# Altium project ISO.PrjPcb
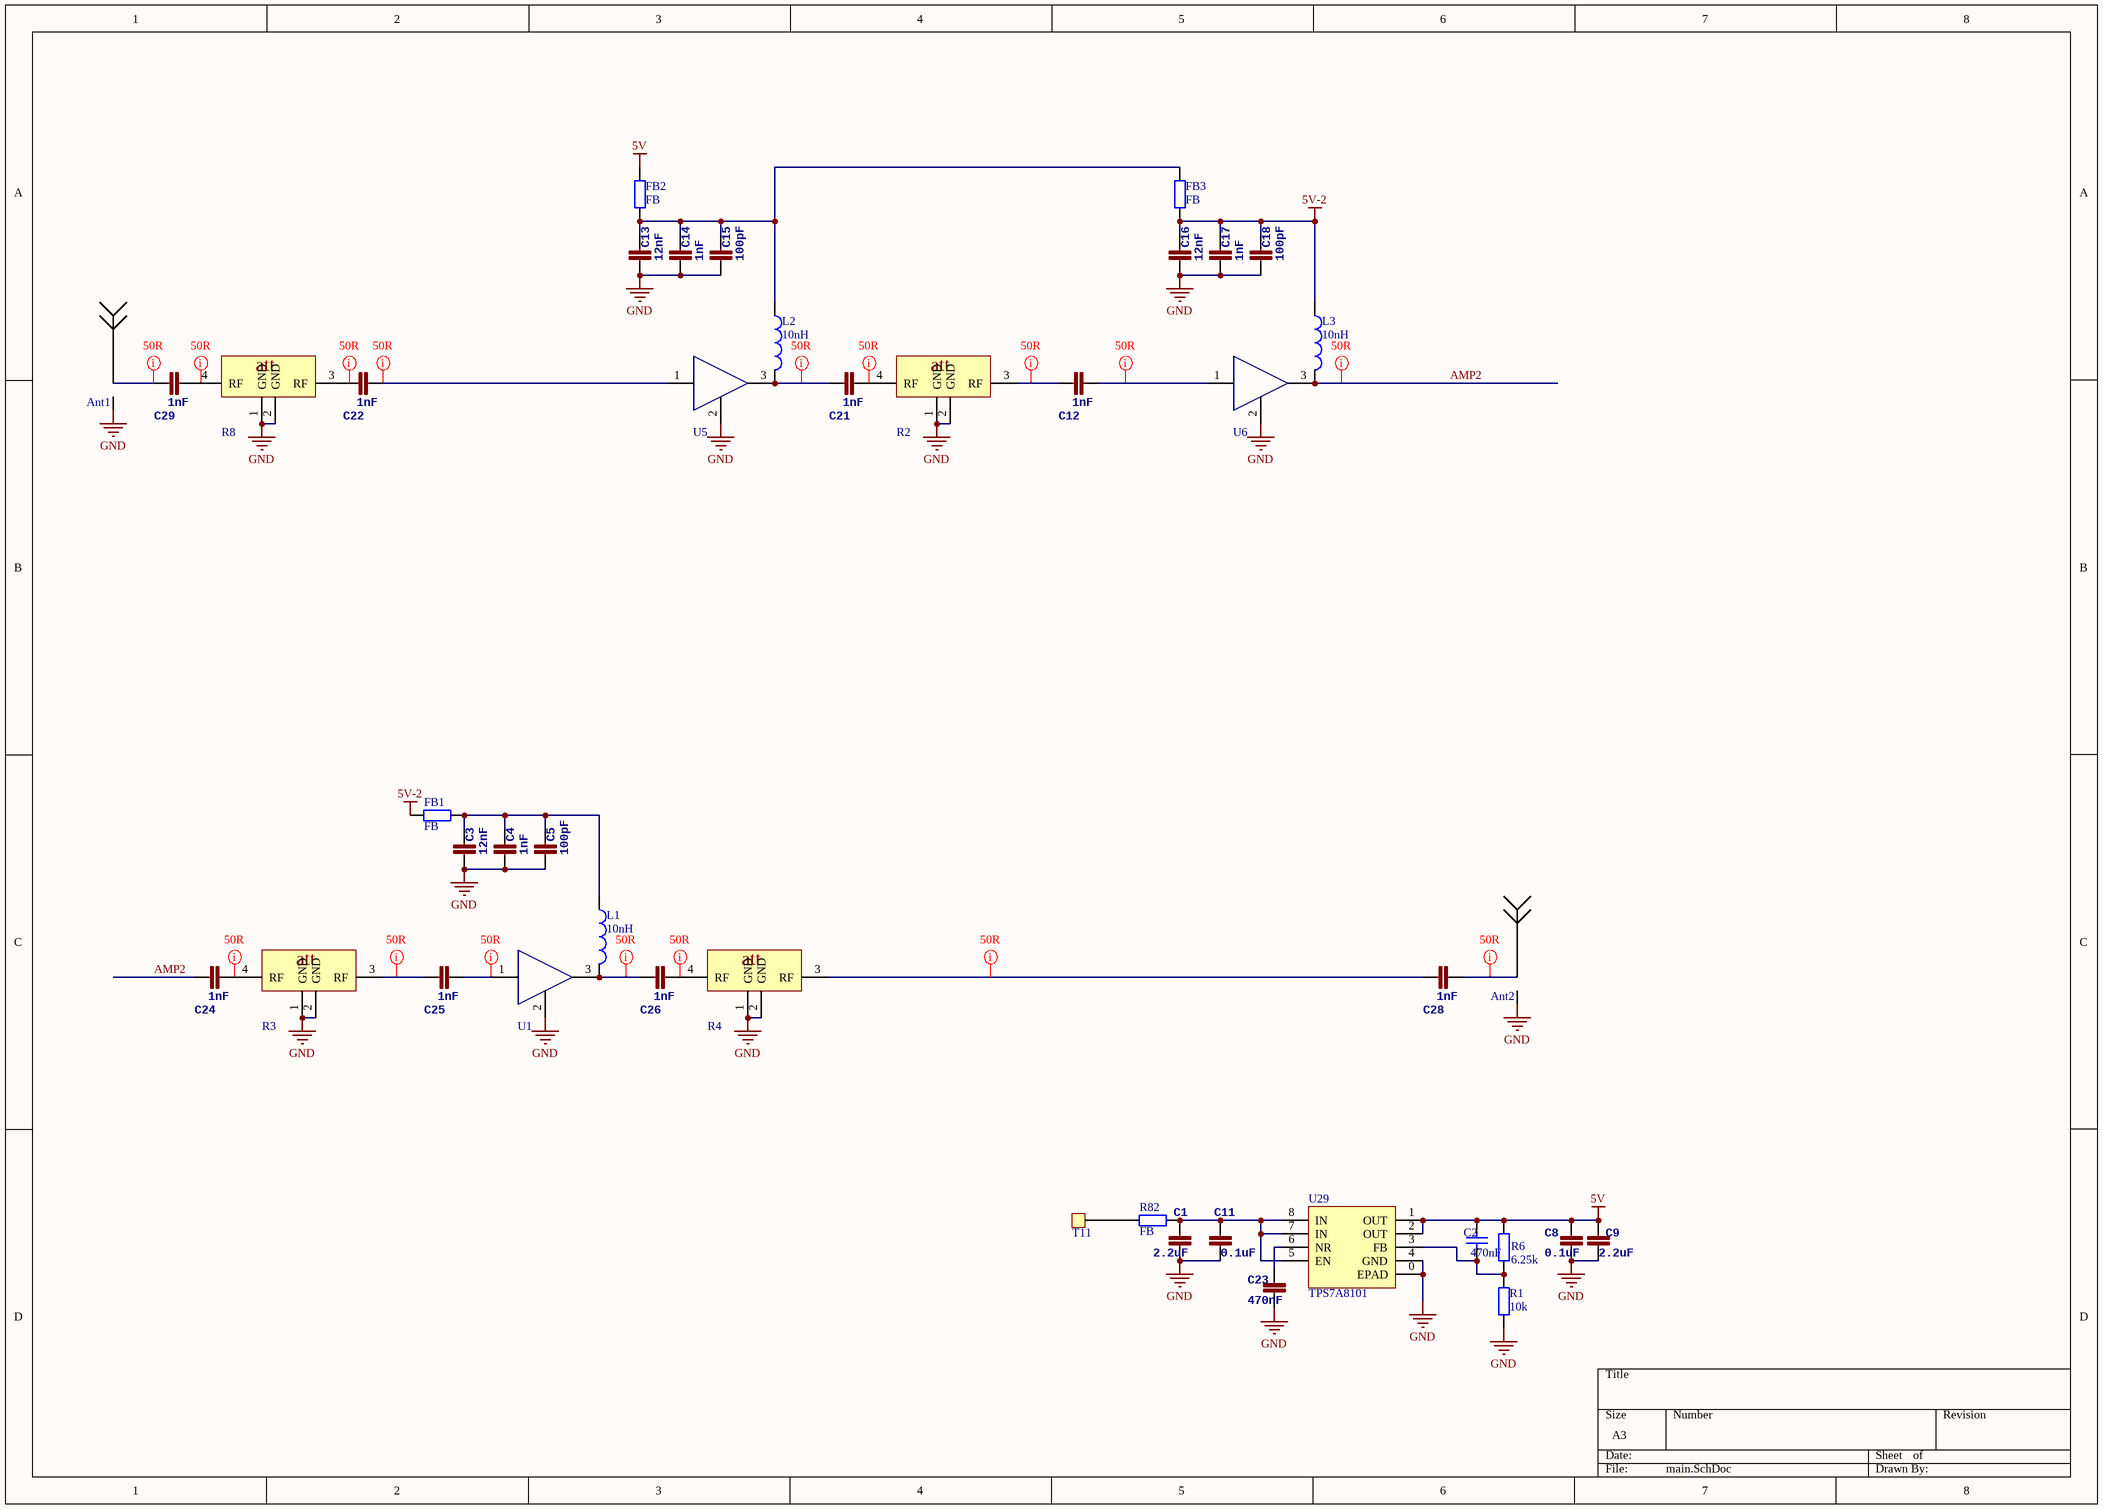
[diagram p0: main.SchDoc]
1 sheet, 43 parts. Net scope: global (net labels, ports and power ports of the same name join across sheets).
Board file: ISO.PcbDoc

## Sheet main.SchDoc
size A3

### Parts
Ant1  Antenna  [SMA-2]  (value not drawn)
Ant2  Antenna  [SMA-2]  (value not drawn)
C1  2.2uF  [0603]
C2  470nF  [0402]
C3  12nF  [0805]
C4  1nF  [0402]
C5  100pF  [0402]
C8  0.1uF  [0603]
C9  2.2uF  [0603]
C11  0.1uF  [0402]
C12  1nF  [0402]
C13  12nF  [0805]
C14  1nF  [0402]
C15  100pF  [0402]
C16  12nF  [0805]
C17  1nF  [0402]
C18  100pF  [0402]
C21  1nF  [0402]
C22  1nF  [0402]
C23  470nF  [0402]
C24  1nF  [0402]
C25  1nF  [0402]
C26  1nF  [0402]
C28  1nF  [0402]
C29  1nF  [0402]
FB1  FB  [0603]
FB2  FB  [0603]
FB3  FB  [0603]
L1  value 10nH  [0402]  (hidden comment: Inductor)
L2  value 10nH  [0402]  (hidden comment: Inductor)
L3  value 10nH  [0402]  (hidden comment: Inductor)
R1  10k  [0402]
R2  EXB24-RF-ATT  [EXB24AT-RF-ATT]  (value not drawn)
R3  EXB24-RF-ATT  [EXB24AT-RF-ATT]  (value not drawn)
R4  EXB24-RF-ATT  [EXB24AT-RF-ATT]  (value not drawn)
R6  6.25k  [0402]
R8  EXB24-RF-ATT  [EXB24AT-RF-ATT]  (value not drawn)
R82  FB  [0603L]
T11  TestPad  [TestPad - 1mm]  (value not drawn)
U1  AMP-SOT89  [SOT-89]  (value not drawn)
U5  AMP-SOT89  [SOT-89]  (value not drawn)
U6  AMP-SOT89  [SOT-89]  (value not drawn)
U29  TPS7A8101  [TPS7A8101]

### Nets
5V: C2.1 C8.2 C9.2 FB2.2 R6.1 U29.1(OUT) U29.2(OUT)
5V-2: C16.2 C17.2 C18.2 FB1.1 FB3.1 L3.1
GND: Ant1.GND(G) Ant2.GND(G) C1.1 C3.1 C4.1 C5.1 C8.1 C9.1 C11.1 C13.1 C14.1 C15.1 C16.1 C17.1 C18.1 C23.1 R1.2 R2.1(GND) R2.2(GND) R3.1(GND) R3.2(GND) R4.1(GND) R4.2(GND) R8.1(GND) R8.2(GND) U1.2 U5.2 U6.2 U29.0(EPAD) U29.4(GND)
AMP2: C24.1 L3.2 U6.3
NetAnt1_1: Ant1.1 C29.1
NetAnt2_1: Ant2.1 C28.2
NetC1_2: C1.2 C11.2 R82.1 U29.5(EN) U29.7(IN) U29.8(IN)
NetC2_2: C2.2 R1.1 R6.2 U29.3(FB)
NetC3_2: C3.2 C4.2 C5.2 FB1.2 L1.1
NetC12_1: C12.1 R2.3(RF)
NetC12_2: C12.2 U6.1
NetC13_2: C13.2 C14.2 C15.2 FB2.1 FB3.2 L2.1
NetC21_1: C21.1 L2.2 U5.3
NetC21_2: C21.2 R2.4(RF)
NetC22_1: C22.1 R8.3(RF)
NetC22_2: C22.2 U5.1
NetC23_2: C23.2 U29.6(NR)
NetC24_2: C24.2 R3.4(RF)
NetC25_1: C25.1 R3.3(RF)
NetC25_2: C25.2 U1.1
NetC26_1: C26.1 L1.2 U1.3
NetC26_2: C26.2 R4.4(RF)
NetC28_1: C28.1 R4.3(RF)
NetC29_2: C29.2 R8.4(RF)
NetR82_2: R82.2 T11.1

### Layout directives
net class 50R: (no net found under the mark), AMP2, NetAnt1_1, NetAnt2_1, NetC12_1, NetC12_2, NetC21_1, NetC21_2, NetC22_2, NetC24_2, NetC25_1, NetC25_2, NetC26_1, NetC26_2, NetC28_1

### Notes on the sheet
- (in symbol EXB24-RF-ATT) att

### Library data of the parts
C1 C3-C5 C8 C9 C11-C18 C21-C26 C28 C29 = CAP0402-CAP: <b>Capacitor</b> / Standard 0603 ceramic capacitor, and 0.1" leaded capacitor.; PARTNO: CC0402ZRY5V7BB104
C2 = Cap: Capacitor; Published: 8-Jun-2000; LatestRevisionDate: 17-Jul-2002; LatestRevisionNote: Re-released for DXP Platform.; PackageReference: RAD-0.3; Publisher: Altium Limited; PackageDescription: Radial Cap, Thru-Hole; 2 Leads; 0.3 in Pin Spacing
FB1-FB3 = Res2: Resistor; Published: 8-Jun-2000; LatestRevisionDate: 17-Jul-2002; LatestRevisionNote: Re-released for DXP Platform.; PackageReference: AXIAL-0.4; Publisher: Altium Limited; PackageDescription: Axial Device, Thru-Hole; 2 Leads; 0.4 in Pin Spacing
L1-L3 = Inductor: Code_IEC: 1005; Published: 8-Jun-2000; LatestRevisionDate: 29-May-2009; LatestRevisionNote: IPC-7351 Footprint Added.; PackageReference: 0402-A; Publisher: Altium Limited; PackageDescription: Chip Inductor; Code_JEITA: 0402
R1 R6 R82 = Res2: Resistor; Value: 0Ohm; Published: 8-Jun-2000; LatestRevisionDate: 17-Jul-2002; LatestRevisionNote: Re-released for DXP Platform.; PackageReference: AXIAL-0.4; Publisher: Altium Limited; PackageDescription: Axial Device, Thru-Hole; 2 Leads; 0.4 in Pin Spacing